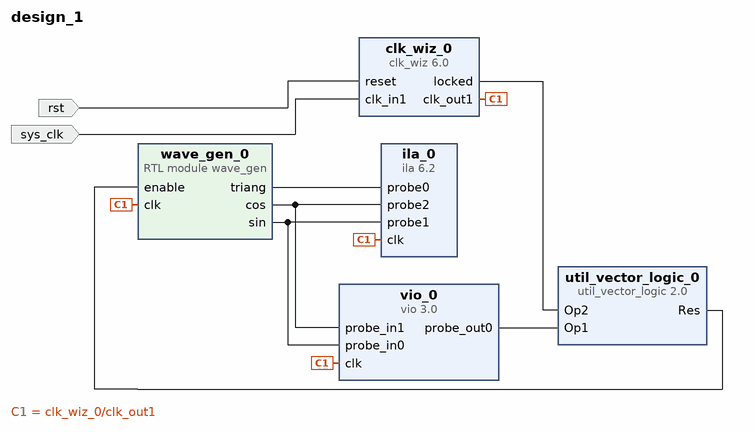
[diagram p0: block diagram of the top level]
# Vivado block design design_1, xc7z010clg400-1, Vivado 2024.1
create_bd_design design_1

create_bd_port -dir I -type clk sys_clk
create_bd_port -dir I -type rst rst
set_property -dict {CONFIG.POLARITY ACTIVE_HIGH} [get_bd_ports rst]

create_bd_cell -type ip -vlnv xilinx.com:ip:clk_wiz:6.0 clk_wiz_0
set_property -dict [list \
  CONFIG.CLKIN1_JITTER_PS 100.0 \
  CONFIG.CLKOUT1_JITTER 290.478 \
  CONFIG.CLKOUT1_PHASE_ERROR 133.882 \
  CONFIG.CLKOUT1_REQUESTED_OUT_FREQ 10 \
  CONFIG.MMCM_CLKFBOUT_MULT_F 15.625 \
  CONFIG.MMCM_CLKIN1_PERIOD 10.000 \
  CONFIG.MMCM_CLKOUT0_DIVIDE_F 78.125 \
  CONFIG.MMCM_DIVCLK_DIVIDE 2 \
] [get_bd_cells clk_wiz_0]
create_bd_cell -type ip -vlnv xilinx.com:ip:vio:3.0 vio_0
set_property -dict {CONFIG.C_NUM_PROBE_IN 2} [get_bd_cells vio_0]
create_bd_cell -type ip -vlnv xilinx.com:ip:ila:6.2 ila_0
set_property -dict [list \
  CONFIG.C_MONITOR_TYPE Native \
  CONFIG.C_NUM_OF_PROBES 3 \
  CONFIG.C_PROBE0_WIDTH 8 \
  CONFIG.C_PROBE1_WIDTH 8 \
  CONFIG.C_PROBE2_WIDTH 8 \
] [get_bd_cells ila_0]
create_bd_cell -type ip -vlnv xilinx.com:ip:util_vector_logic:2.0 util_vector_logic_0
set_property -dict {CONFIG.C_SIZE 1} [get_bd_cells util_vector_logic_0]
create_bd_cell -type module -reference wave_gen wave_gen_0

# ---- connections ----

connect_bd_net [get_bd_pins clk_wiz_0/clk_out1] [get_bd_pins vio_0/clk] [get_bd_pins ila_0/clk] [get_bd_pins wave_gen_0/clk]
connect_bd_net [get_bd_pins clk_wiz_0/locked] [get_bd_pins util_vector_logic_0/Op2]
connect_bd_net -net reset_0_1 [get_bd_ports rst] [get_bd_pins clk_wiz_0/reset]
connect_bd_net [get_bd_ports sys_clk] [get_bd_pins clk_wiz_0/clk_in1]
connect_bd_net [get_bd_pins util_vector_logic_0/Res] [get_bd_pins wave_gen_0/enable]
connect_bd_net [get_bd_pins vio_0/probe_out0] [get_bd_pins util_vector_logic_0/Op1]
connect_bd_net [get_bd_pins wave_gen_0/cos] [get_bd_pins vio_0/probe_in1] [get_bd_pins ila_0/probe2]
connect_bd_net [get_bd_pins wave_gen_0/sin] [get_bd_pins vio_0/probe_in0] [get_bd_pins ila_0/probe1]
connect_bd_net [get_bd_pins wave_gen_0/triang] [get_bd_pins ila_0/probe0]

validate_bd_design
save_bd_design
